# Altium schematic sheet User - User Led's.SchDoc: [13] User - User Led's
size A4; ApprovedBy: Nagy Richard; CheckedBy: Nagy Richard; Author: Nagy Richard; CompanyName: EmbedCore; DrawnBy: Nagy Richard; Engineer: Nagy Richard; Organization: EmbedCore; DocumentNumber: 13; Revision: 1.0; SheetNumber: 14; SheetTotal: 15
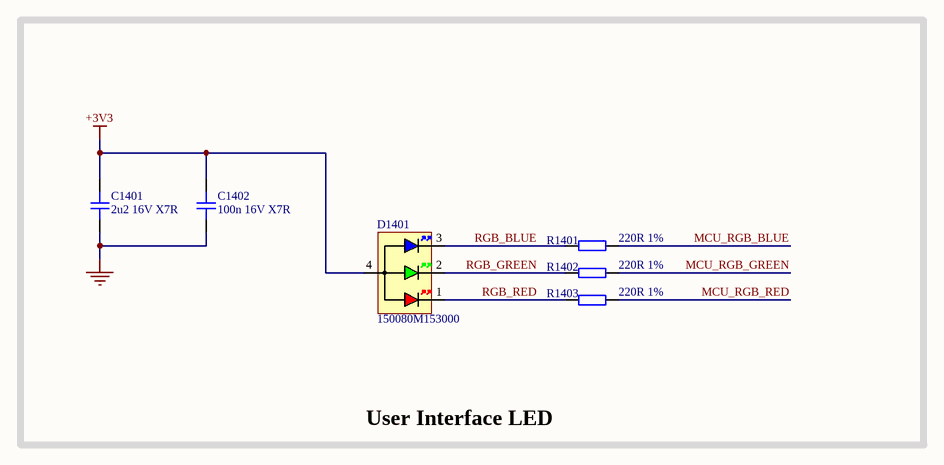
[diagram p0: User - User Led's.SchDoc]

## Parts
C1401  2u2 16V X7R  [CAP_0603]
C1402  100n 16V X7R  [CAP_0402]
D1401  150080M153000  [150080M153000]
R1401  220R 1%  [RES_0402]
R1402  220R 1%  [RES_0402]
R1403  220R 1%  [RES_0402]

## Blocks framed on the sheet
User Interface LED: C1401 C1402 D1401 R1401-R1403

## Nets
+3V3: C1401.2 C1402.2 D1401.4(AC)
GND: C1401.1 C1402.1
MCU_RGB_BLUE: R1401.1
MCU_RGB_GREEN: R1402.1
MCU_RGB_RED: R1403.1
RGB_BLUE: D1401.3(CB) R1401.2
RGB_GREEN: D1401.2(CG) R1402.2
RGB_RED: D1401.1(CR) R1403.2

## Notes on the sheet
- Title:
- Drawn By:
- Page Contents:
- Checked By:
- Size:
- Date:
- File:
- License:
- Email:
- A4
- Number:
- Time:
- Revision:
- Sheet
- Website:
- of

## Library data of the parts
C1401 = CAP_0603: Capacitor SMD 0603; Manufacturer: YAGEO; Manufacturer Part Number: CC0603KRX7R7BB225; Distributor Link: www.lcsc.com; LCSC: C914769; Rating: *; Dielectric: *
C1402 = CAP_0402: Capacitor SMD 0402; Manufacturer: YAGEO; Manufacturer Part Number: CC0402JRX7R7BB104; Distributor Link: www.lcsc.com; LCSC: C541464; Rating: *; Dielectric: *
D1401 = 150080M153000: RGB LED Common Anode SMD Diffused 0805 Top View; Manufacturer: Wurth; Manufacturer Part Number: 150080M153000; Distributor Link: https://www.mouser.de/ProductDetail/Wurth-Elektronik/150080M153000?qs=5aG0NVq1C4wI5cZ2wabu5A%3D%3D
R1401-R1403 = RES_0402: Resistor SMD 0402; Manufacturer: PANASONIC; Manufacturer Part Number: ERJPA2F1002X; Distributor Link: www.lcsc.com; LCSC: C409028